# EAGLE design HeaterController (EAGLE 7.7.0)
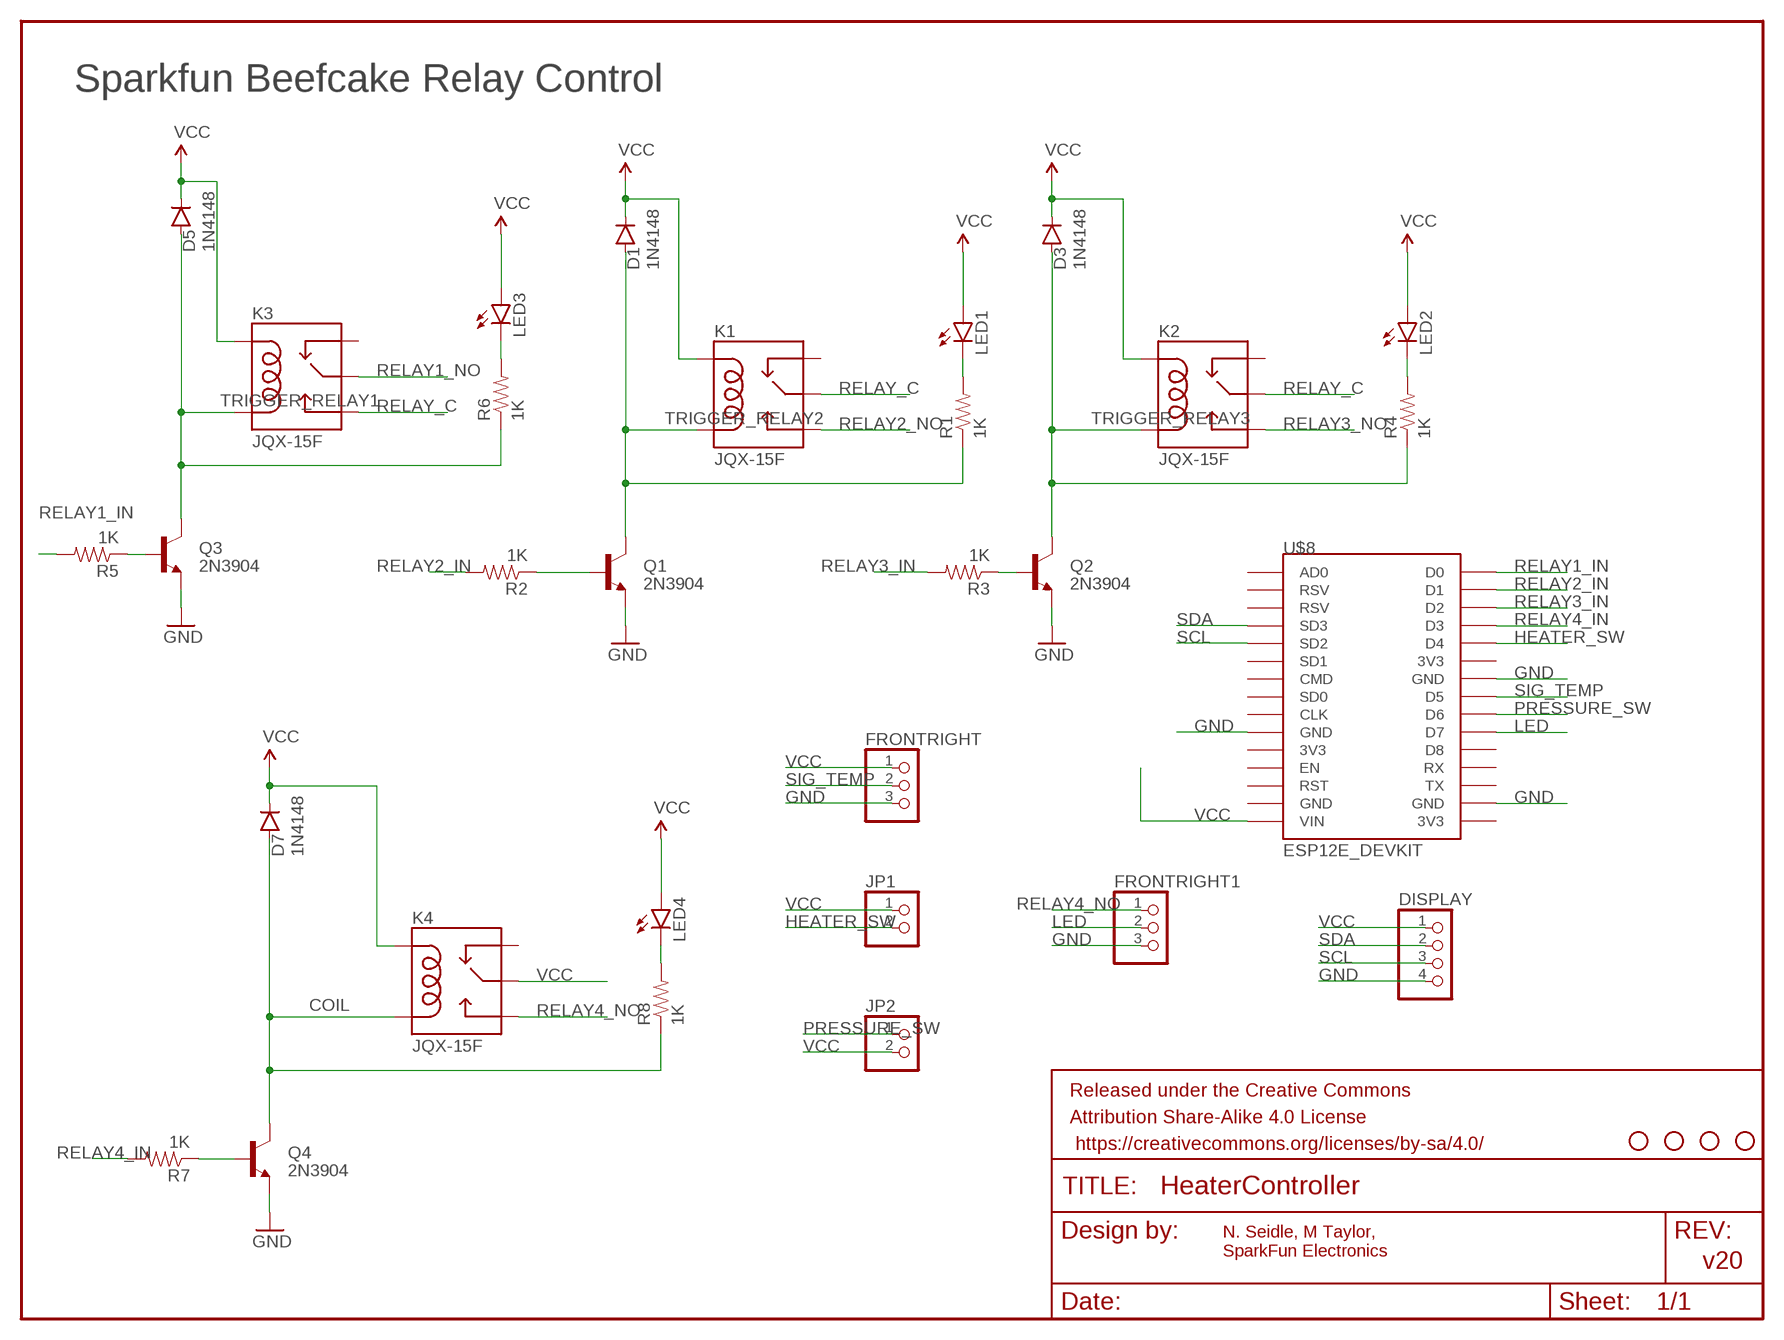
[diagram p0: schematic, sheet 1]

## Parts
D1  1N4148  DIODEKIT  [DIODE-1N4148-KIT]
D3  1N4148  DIODEKIT  [DIODE-1N4148-KIT]
D5  1N4148  DIODEKIT  [DIODE-1N4148-KIT]
D7  1N4148  DIODEKIT  [DIODE-1N4148-KIT]
DISPLAY  PINHD-1X4  [1X04]
FRAME2  FRAME-LETTER  [CREATIVE_COMMONS]
FRONTRIGHT  PINHD-1X3  [1X03]
FRONTRIGHT1  PINHD-1X3  [1X03]
JP1  PINHD-1X2  [1X02]
JP2  PINHD-1X2  [1X02]
K1  JQX-15F  RELAYPTH5  [RELAY-T90]
K2  JQX-15F  RELAYPTH5  [RELAY-T90]
K3  JQX-15F  RELAYPTH5  [RELAY-T90]
K4  JQX-15F  RELAYPTH5  [RELAY-T90]
LED1  LED5MM-KIT  [LED5MM-KIT]
LED2  LED5MM-KIT  [LED5MM-KIT]
LED3  LED5MM-KIT  [LED5MM-KIT]
LED4  LED5MM-KIT  [LED5MM-KIT]
Q1  2N3904  TRANSISTOR_NPN2N3904-EZ  [TO-92-EZ]
Q2  2N3904  TRANSISTOR_NPN2N3904-EZ  [TO-92-EZ]
Q3  2N3904  TRANSISTOR_NPN2N3904-EZ  [TO-92-EZ]
Q4  2N3904  TRANSISTOR_NPN2N3904-EZ  [TO-92-EZ]
R1  1K  1KOHM-1/4W-1%(PTH)HORIZ-KIT  [AXIAL-0.3EZ]
R2  1K  1KOHM-1/4W-1%(PTH)HORIZ-KIT  [AXIAL-0.3EZ]
R3  1K  1KOHM-1/4W-1%(PTH)HORIZ-KIT  [AXIAL-0.3EZ]
R4  1K  1KOHM-1/4W-1%(PTH)HORIZ-KIT  [AXIAL-0.3EZ]
R5  1K  1KOHM-1/4W-1%(PTH)HORIZ-KIT  [AXIAL-0.3EZ]
R6  1K  1KOHM-1/4W-1%(PTH)HORIZ-KIT  [AXIAL-0.3EZ]
R7  1K  1KOHM-1/4W-1%(PTH)HORIZ-KIT  [AXIAL-0.3EZ]
R8  1K  1KOHM-1/4W-1%(PTH)HORIZ-KIT  [AXIAL-0.3EZ]
U$3  STAND-OFF  [STAND-OFF]
U$4  STAND-OFF  [STAND-OFF]
U$5  STAND-OFF  [STAND-OFF]
U$7  STAND-OFF  [STAND-OFF]
U$8  ESP12E_DEVKIT  [ESP12E_DEVKIT]

## Nets
COIL: D7.A K4.COIL2 Q4.3(C) R8.P$1
GND: DISPLAY.4 FRONTRIGHT1.3 FRONTRIGHT.3 Q1.1(E) Q2.1(E) Q3.1(E) Q4.1(E) U$8.GND@0(GND) U$8.GND@2(GND) U$8.GND@3(GND)
HEATER_SW: JP1.2 U$8.D4
LED: FRONTRIGHT1.2 U$8.D7
N$1: Q2.2(B) R3.P$1
N$2: LED2.K(C) R4.P$2
N$3: Q3.2(B) R5.P$1
N$4: LED3.K(C) R6.P$2
N$5: Q4.2(B) R7.P$1
N$6: Q1.2(B) R2.P$1
N$7: LED4.K(C) R8.P$2
N$9: LED1.K(C) R1.P$2
PRESSURE_SW: JP2.1 U$8.D6
RELAY1_IN: R5.P$2 U$8.D0
RELAY1_NO: K3.MAIN
RELAY2_IN: R2.P$2 U$8.D1
RELAY2_NO: K1.NO
RELAY3_IN: R3.P$2 U$8.D2
RELAY3_NO: K2.NO
RELAY4_IN: R7.P$2 U$8.D3
RELAY4_NO: FRONTRIGHT1.1 K4.NO
RELAY_C: K1.MAIN K2.MAIN K3.NO
SCL: DISPLAY.3 U$8.SD2
SDA: DISPLAY.2 U$8.SD3
SIG_TEMP: FRONTRIGHT.2 U$8.D5
TRIGGER_RELAY1: D5.A K3.COIL2 Q3.3(C) R6.P$1
TRIGGER_RELAY2: D1.A K1.COIL2 Q1.3(C) R1.P$1
TRIGGER_RELAY3: D3.A K2.COIL2 Q2.3(C) R4.P$1
VCC: D1.C D3.C D5.C D7.C DISPLAY.1 FRONTRIGHT.1 JP1.1 JP2.2 K1.COIL1 K2.COIL1 K3.COIL1 K4.COIL1 K4.MAIN LED1.A LED2.A LED3.A LED4.A U$8.VIN
Unconnected: K1.NC K2.NC K3.NC K4.NC U$8.3V3@0(3V3) U$8.3V3@1(3V3) U$8.3V3@2(3V3) U$8.AD0 U$8.CLK U$8.CMD U$8.D8 U$8.EN U$8.GND@1(GND) U$8.RST U$8.RSV@0(RSV) U$8.RSV@1(RSV) U$8.RX U$8.SD0 U$8.SD1 U$8.TX

## Notes on the sheet
- Sparkfun Beefcake Relay Control
- N. Seidle, M Taylor,
  SparkFun Electronics
- v20

## Library data of the parts
D1 D3 D5 D7 = SparkFun-DiscreteSemi:DIODE: Diode These are standard reverse protection diodes and small signal diodes. SMA package can handle up to about 1A. SOD-323 can handle about 200mA. What the SOD-323 package when ordering, there are some mfgs out there that are 5-pin packages.; PROD_ID: DIO-08378
DISPLAY = pinhead:PINHD-1X4: PIN HEADER
FRAME2 = SparkFun-Aesthetics:FRAME-LETTER: Schematic Frame Standard 8.5x11 US Letter frame
FRONTRIGHT FRONTRIGHT1 = pinhead:PINHD-1X3: PIN HEADER
JP1 JP2 = pinhead:PINHD-1X2: PIN HEADER
K1-K4 = SparkFun-Electromechanical:RELAY: SPDT relay (COM-00101); PROD_ID: COMP-10736
LED1-LED4 = SparkFun-LED:LED: LEDs Standard schematic elements and footprints for 5mm, 3mm, 1206, and 0603 sized LEDs. 5mm - Spark Fun Electronics SKU : COM-00529 (and others); PROD_ID: DIO-09529
Q1-Q4 = SparkFun-DiscreteSemi:TRANSISTOR_NPN: Generic NPN BJT MMBT2222A - TRANS-08049 (SOT-23, 1A 40V) MPSA42 - TRANS-09116 (SOT-23, 500mA 300V) MMBT5088LT1G - TRANS-11160 (SOT-23, 50 mA 30V) BC547 - COM-08928 <http://www.sparkfun.com/products/8928> (TO-92 45V 100mA) (1.Collector 2.Base 3.Emitter) 2N3904 - COM-00521 <http://www.sparkfun.com/products/521> (TO-92 40V 200mA) (1.Emitter 2.Base 3.Collector) P2N2222A - COM-12852 <http://www.sparkfun.com/products/12852> (TO-92 40V 600mA) (1.Collector 2.Base 3.Emitter); PROD_ID: TRANS-08447
R1-R8 = SparkFun-Resistors:1KOHM-1/4W-1%(PTH): RES-12182; PROD_ID: RES-12182
U$3-U$5 U$7 = SparkFun:STAND-OFF: Stand Off This is the mechanical footprint for a #4 phillips button head screw. Use the keepout ring to avoid running the screw head into surrounding components. SKU : PRT-00447
U$8 = NodeMCU:ESP12E_DEVKIT: ESP12E DEVKIT BOARD

## Net classes
1 vcc: width 0.254 mm

## Board
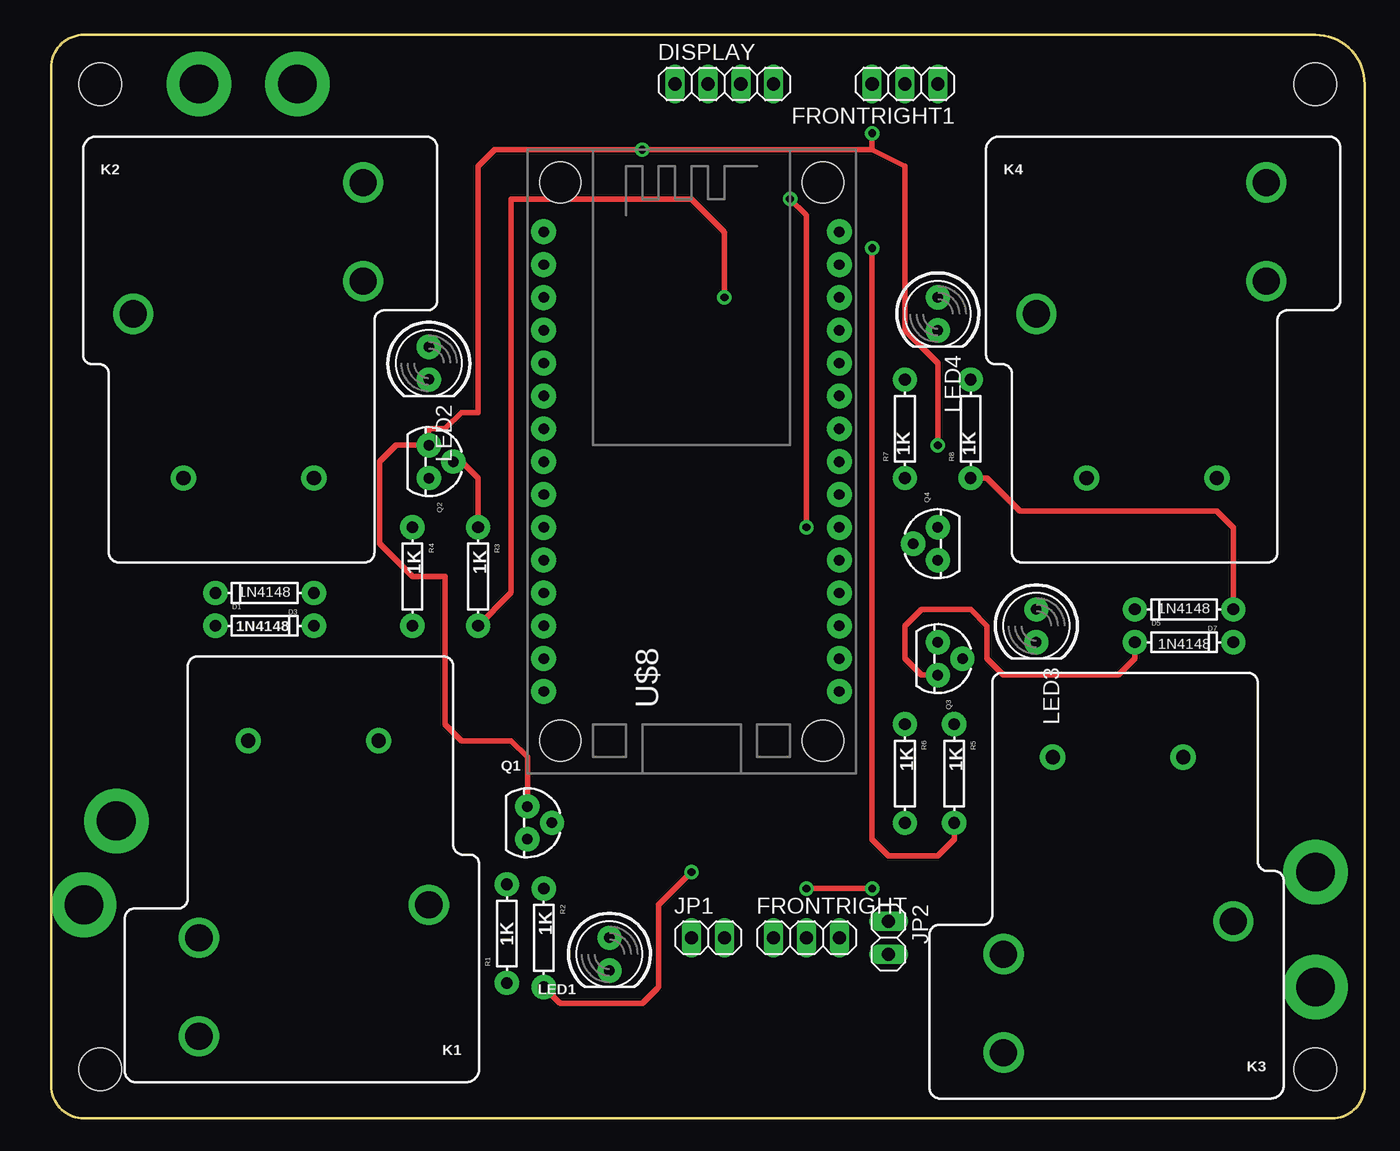
[diagram p1: board, top side]
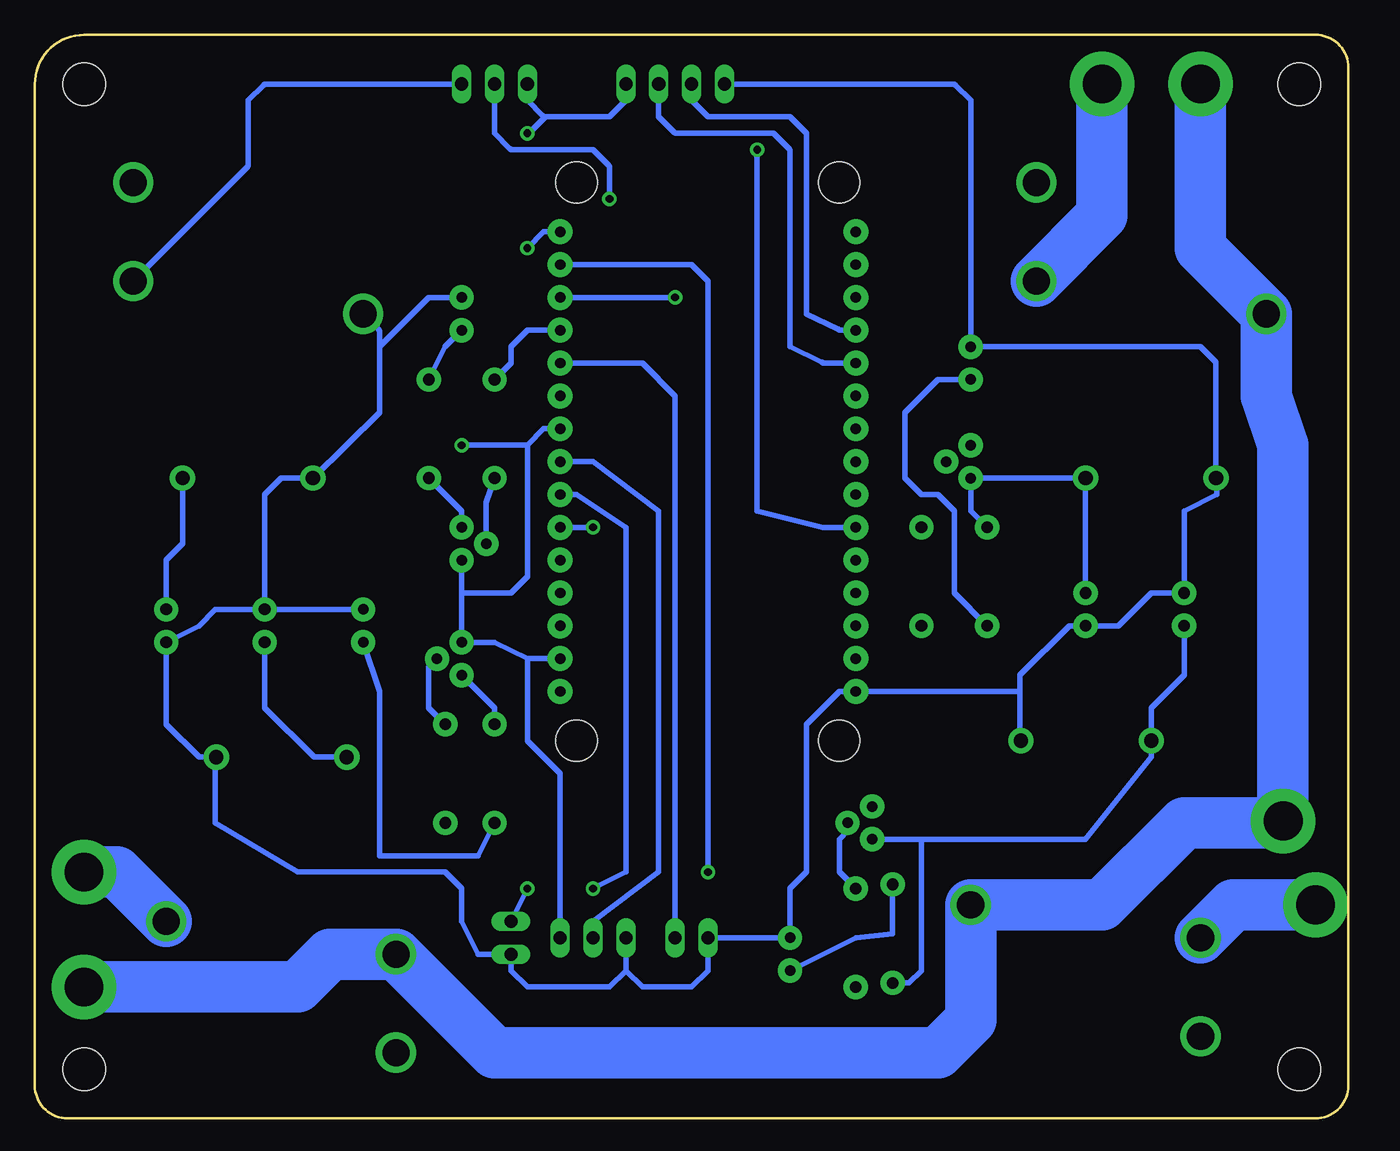
[diagram p2: board, bottom side, seen from below]

Size 101.6 x 83.82 mm. Coordinates in mm from the lower left corner, seen from the top.
Outline: 2.54,83.82 97.79,83.82 arc-90 101.6,80.01 101.6,2.54 arc-90 99.06,0 2.54,0 arc-90 0,2.54 0,81.28 arc-90 2.54,83.82
Copper layers (1*16): Top 0.035mm / dielectric 1.5mm / Bottom 0.035mm
Design rules "SparkFun-2-layer-STANDARD *": minimum track width 10mil, minimum drill 20mil, track to track 10mil, track to pad 8mil, pad to pad 8mil, via to via 10mil, smd to smd 8mil, copper to edge 8mil, drill to drill 8mil, minimum pad ring 10mil, minimum via ring 10mil, stop-mask expansion 4mil, vias tented up to drill 20mil, thermal gap 10mil
Milling: 8 lines

### Footprints (pad centres in the part's own frame; a part is rotated, then mirrored left to right if it is on the bottom)
DIODE-1N4148-KIT = drill 0.9 pad 1.88: A -3.81,0; C 3.81,0
1X04 = drill 1.016 long: 1 -3.81,0; 2 -1.27,0; 3 1.27,0; 4 3.81,0
1X03 = drill 1.016 long: 1 -2.54,0; 2 0,0; 3 2.54,0
1X02 = drill 1.016 long: 1 -1.27,0; 2 1.27,0
RELAY-T90 = drill 1.1 pad 1.956: COIL1 0,-13.9; COIL2 0,-3.81 | drill 2.1: MAIN -12.7,-17.78; NC -22.86,0; NO -15.24,0
LED5MM-KIT = drill 0.813 pad 1.88: A -1.27,0; K 1.27,0
TO-92-EZ = drill 0.813 pad 1.88: 1 -1.27,0; 2 0,1.905; 3 1.27,0
AXIAL-0.3EZ = drill 0.9 pad 1.88: P$1 -3.81,0; P$2 3.81,0
STAND-OFF = hole 3.302: 0,0
ESP12E_DEVKIT = drill 0.8 pad 1.93: 3V3@0 -11.43,-7.62; 3V3@1 11.43,5.08; 3V3@2 11.43,-17.78; AD0 -11.43,17.78; CLK -11.43,-2.54; CMD -11.43,2.54; D0 11.43,17.78; D1 11.43,15.24; D2 11.43,12.7; D3 11.43,10.16; D4 11.43,7.62; D5 11.43,0; D6 11.43,-2.54; D7 11.43,-5.08; D8 11.43,-7.62; EN -11.43,-10.16; GND@0 -11.43,-5.08; GND@1 -11.43,-15.24; GND@2 11.43,2.54; GND@3 11.43,-15.24; RST -11.43,-12.7; RSV@0 -11.43,15.24; RSV@1 -11.43,12.7; RX 11.43,-10.16; SD0 -11.43,0; SD1 -11.43,5.08; SD2 -11.43,7.62; SD3 -11.43,10.16; TX 11.43,-12.7; VIN -11.43,-17.78 | hole 3.2: -10.16,21.59; 10.16,21.59; 10.16,-21.59; -10.16,-21.59

### Placement (x,y rotation side)
D1  16.51,38.1 0 top
D3  16.51,40.64 180 top
D5  87.63,36.83 0 top
D7  87.63,39.37 180 top
DISPLAY  52.07,80.01 0 top
FRAME2  -1.14,-13.08 0 top  (outside the outline)
FRONTRIGHT  58.42,13.97 0 top
FRONTRIGHT1  66.04,80.01 180 top
JP1  50.8,13.97 0 top
JP2  64.77,13.97 270 top
K1  11.43,29.21 90 top
K2  24.13,49.53 270 top
K3  73.66,27.94 90 top
K4  93.98,49.53 270 top
LED1  43.18,12.7 270 top
LED2  29.21,58.42 270 top
LED3  76.2,38.1 270 top
LED4  68.58,62.23 270 top
Q1  36.83,22.86 270 top
Q2  29.21,50.8 270 top
Q3  68.58,35.56 270 top
Q4  68.58,44.45 90 top
R1  35.24,14.29 90 top
R2  38.1,13.97 270 top
R3  33.02,41.91 270 top
R4  27.94,41.91 270 top
R5  69.85,26.67 270 top
R6  66.04,26.67 270 top
R7  66.04,53.34 90 top
R8  71.12,53.34 90 top
U$3  3.81,3.81 0 top
U$4  97.79,3.81 0 top
U$5  97.79,80.01 0 top
U$7  3.81,80.01 0 top
U$8  49.53,50.8 0 top

### Tracks (layer width: path | path; a pad name or v marks a point on that pad's centre or on a via)
COIL
  Top 0.406: R8.P$1 72.39,49.53 74.93,46.99 90.17,46.99 91.44,45.72 D7.A
  Bottom 0.406: K4.COIL2 90.17,44.45 91.44,43.18 D7.A | R8.P$1 68.58,46.99 Q4.3
COMMON  (via drill 3 pad 5)
  other vias: 5.04,23
GND  (via drill 0.6 pad 0.41)
  Top 0.406: 63.5,74.93 v45.72,74.93 34.29,74.93 33.02,73.66 33.02,54.61 31.75,54.61 30.48,53.34 29.21,53.34 Q2.1 26.67,52.07 25.4,50.8 25.4,44.45 27.94,41.91 30.48,41.91 30.48,30.48 31.75,29.21 35.56,29.21 36.83,27.94 Q1.1 | 63.5,74.93 66.04,73.66 66.04,60.96 68.58,58.42 v68.58,52.07 | 63.5,74.93 v63.5,76.2
  Bottom 0.406: U$8.GND@3 63.5,35.56 | 63.5,35.56 66.04,36.83 Q3.1 68.58,40.64 | Q4.1 68.58,40.64 | U$8.GND@2 62.23,53.34 63.5,52.07 | 63.5,52.07 63.5,41.91 64.77,40.64 68.58,40.64 | v68.58,52.07 63.5,52.07 | U$8.GND@0 40.64,45.72 45.72,46.99 v45.72,74.93 | FRONTRIGHT.3 60.96,26.67 63.5,29.21 63.5,35.56 | DISPLAY.4 55.88,78.87 arc45 55.97,78.65 57.15,77.47 62.1,77.47 | 62.1,77.47 arc45 62.32,77.56 63.5,78.74 FRONTRIGHT1.3 | v63.5,76.2 arc-45 63.27,76.29 62.1,77.47
HEATER_SW
  Bottom 0.406: JP1.2 52.07,55.88 54.61,58.42 U$8.D4
LED  (via drill 0.6 pad 0.41)
  Top 0.406: v58.42,45.72 58.42,69.72 arc45 58.33,69.94 v57.15,71.12
  Bottom 0.406: U$8.D7 v58.42,45.72 | v57.15,71.12 57.15,73.53 arc-45 57.24,73.75 58.42,74.93 64.64,74.93 arc45 64.86,75.02 66.04,76.2 FRONTRIGHT1.2
N$1
  Top 0.406: Q2.2 31.75,50.8 33.02,49.53 R3.P$1
N$2
  Bottom 0.406: LED2.K 31.75,57.15 34.29,54.61 34.29,49.53 33.02,48.26 31.75,48.26 30.48,46.99 30.48,40.64 R4.P$2
N$3
  Bottom 0.406: R5.P$1 71.12,31.75 71.12,34.92 Q3.2
N$4
  Bottom 0.406: R6.P$2 67.31,20.32 74.93,20.32 74.93,33.02 LED3.K
N$5
  Bottom 0.406: Q4.2 66.67,47.62 R7.P$1
N$6
  Bottom 0.406: Q1.2 38.73,22.23 39.37,21.59 39.37,19.05 R2.P$1
N$7
  Bottom 0.406: LED4.K 69.85,59.69 R8.P$2
N$9
  Bottom 0.406: R1.P$2 35.24,14.29 38.1,13.97 LED1.K
PRESSURE_SW  (via drill 0.6 pad 0.41)
  Top 0.406: v58.42,17.78 v63.5,17.78
  Bottom 0.406: U$8.D6 59.69,48.26 55.88,45.72 55.88,19.05 v58.42,17.78 | v63.5,17.78 JP2.1
RELAY1_IN  (via drill 0.6 pad 0.41)
  Top 0.406: v63.5,67.31 63.5,21.59 64.77,20.32 68.58,20.32 69.85,21.59 R5.P$2
  Bottom 0.406: U$8.D0 62.23,68.58 v63.5,67.31
RELAY1_NO  (via drill 3 pad 5)
  Bottom 4: K3.MAIN 95.25,19.05 v97.79,19.05
RELAY2_IN  (via drill 0.6 pad 0.41)
  Top 0.406: v49.53,19.05 46.99,16.51 46.99,10.29 arc-45 46.9,10.07 45.72,8.89 39.5,8.89 arc-45 39.28,8.98 R2.P$2
  Bottom 0.406: U$8.D1 50.8,66.04 49.53,64.77 v49.53,19.05
RELAY2_NO  (via drill 3 pad 5)
  Bottom 4: K1.NO 8.89,16.51 v2.54,16.51
RELAY3_IN  (via drill 0.6 pad 0.41)
  Top 0.406: v52.07,63.5 52.07,68.45 arc45 51.98,68.67 49.53,71.12 35.56,71.12 35.56,40.77 arc-45 35.47,40.55 R3.P$2
  Bottom 0.406: U$8.D2 v52.07,63.5
RELAY3_NO  (via drill 3 pad 5)
  Bottom 4: K2.NO 19.05,69.85 v19.05,80.01
RELAY4_IN
  Bottom 0.406: U$8.D3 63.5,60.96 64.77,59.69 64.77,58.42 R7.P$2
RELAY4_NO
  Bottom 0.406: FRONTRIGHT1.1 83.69,80.01 arc-45 83.91,79.92 85.09,78.74 85.09,73.79 arc45 85.18,73.57 K4.NO
RELAY_C  (via drill 3 pad 5)
  Bottom 4: v11.43,80.01 11.43,67.31 K2.MAIN 6.35,55.88 5.08,52.07 5.08,22.86 12.7,22.86 19.05,16.51 K1.MAIN 29.21,7.62 31.75,5.08 66.04,5.08 K3.NO 78.74,12.7 81.28,10.16 v97.79,10.16
SCL
  Bottom 0.406: U$8.SD2 40.51,58.42 arc45 40.73,58.51 43.18,59.69 43.18,74.8 arc-45 43.27,75.02 44.45,76.2 51.94,76.2 arc45 52.16,76.29 53.34,77.47 DISPLAY.3
SDA
  Bottom 0.406: U$8.SD3 39.24,60.96 arc45 39.46,61.05 41.91,62.23 41.91,76.2 43.18,77.47 49.4,77.47 arc45 49.62,77.56 50.8,78.74 DISPLAY.2
SIG_TEMP
  Bottom 0.406: FRONTRIGHT.2 58.42,15.24 53.34,19.05 53.34,46.99 58.42,50.8 U$8.D5
TRIGGER_RELAY1
  Top 0.406: Q3.3 67.31,34.29 66.04,35.56 66.04,38.1 67.31,39.37 71.12,39.37 72.39,38.1 72.39,35.56 73.66,34.29 82.55,34.29 83.82,35.56 D5.A
  Bottom 0.406: K3.COIL2 80.01,27.94 83.82,31.75 D5.A | R6.P$1 66.04,31.75 Q3.3
TRIGGER_RELAY2
  Bottom 0.406: 33.02,21.59 20.32,21.59 15.24,27.94 K1.COIL2 15.24,31.75 12.7,34.29 D1.A | 33.02,21.59 Q1.3 | R1.P$1 33.97,10.48 33.02,11.43 33.02,21.59
TRIGGER_RELAY3
  Bottom 0.406: R4.P$1 29.21,46.99 Q2.3 K2.COIL2 D3.A
VCC
  Bottom 0.406: D7.C 87.63,39.37 88.9,38.1 D5.C 91.44,30.48 88.9,27.94 K3.COIL1 87.63,27.87 87.63,22.86 81.28,19.05 69.85,19.05 68.58,17.78 68.58,15.24 67.31,12.7 JP2.2 64.77,11.43 63.5,10.16 57.15,10.16 55.88,11.43 | 74.93,59.69 71.12,63.5 LED4.A | 74.93,59.69 74.93,54.61 77.47,52.07 K4.COIL1 82.55,49.53 83.82,48.26 D7.C | LED3.A D7.C | 25.4,29.21 K1.COIL1 25.4,29.28 25.4,33.02 | 25.4,33.02 U$8.VIN 39.37,33.02 41.91,30.48 41.91,19.05 43.18,17.78 LED1.A JP1.1 49.53,11.43 50.8,10.16 54.61,10.16 55.88,11.43 | 55.88,11.43 FRONTRIGHT.1 | 25.4,33.02 25.4,34.29 21.59,38.1 D1.C 17.78,38.1 15.24,40.64 D3.C 12.7,46.99 10.16,48.26 10.16,49.46 K2.COIL1 10.23,58.49 11.43,59.69 LED2.A 29.21,78.74 30.39,79.92 arc-45 30.61,80.01 DISPLAY.1 | 74.93,59.69 74.93,60.83 arc-45 75.02,61.05 K4.MAIN

### Text on the board
Measures: Units in inches
tDocu: Both layers to be 2 OZ copper | N. Seidle/M. Taylor